# EAGLE design MCU (EAGLE 6.5.0)
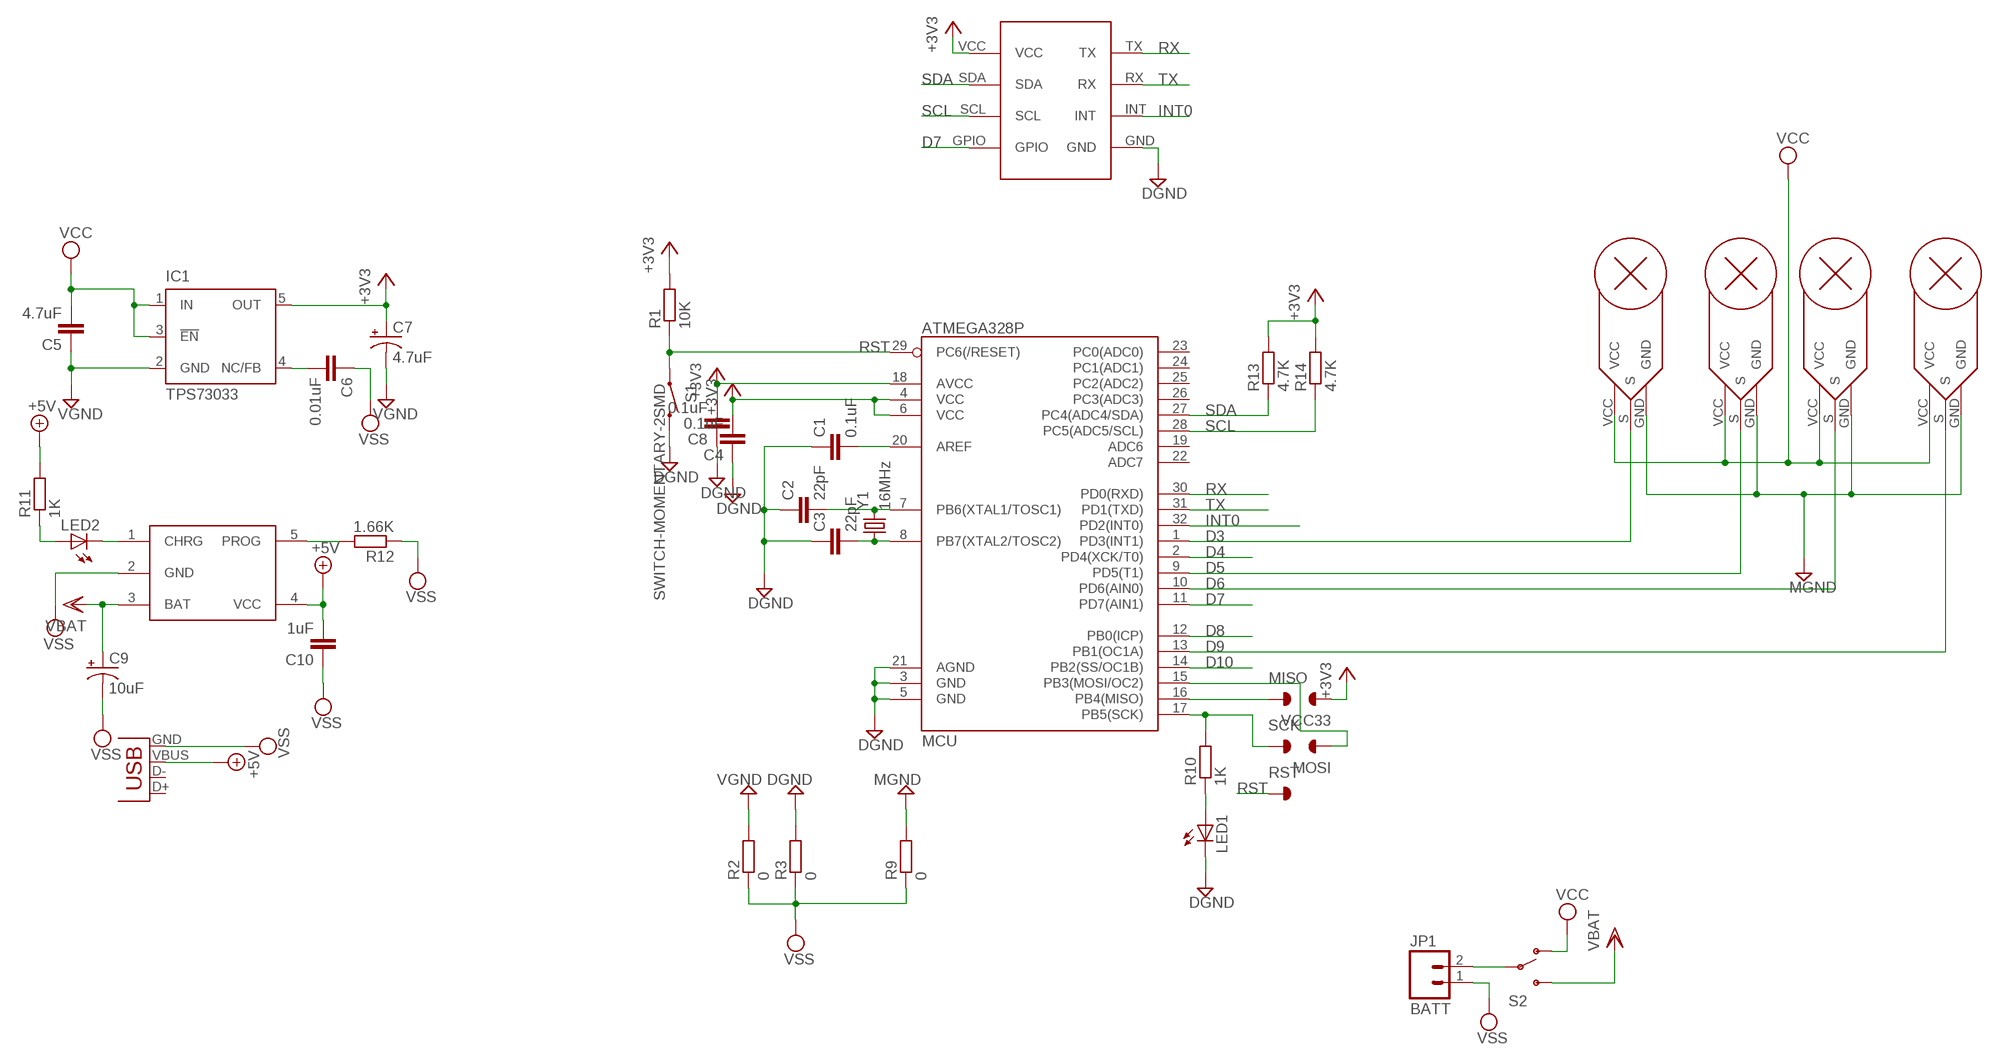
[diagram p0: schematic, sheet 1]

## Parts
C1  0.1uF  C-EUC0805  [C0805]
C2  22pF  C-EUC0603  [C0603]
C3  22pF  C-EUC0603  [C0603]
C4  0.1uF  C-EUC0805  [C0805]
C5  4.7uF  C-EUC0805  [C0805]
C6  0.01uF  C-EUC0805  [C0805]
C7  4.7uF  CAP_POL1206  [EIA3216]
C8  0.1uF  C-EUC0805  [C0805]
C9  10uF  CAP_POL1206  [EIA3216]
C10  1uF  C-EUC0805  [C0805]
IC1  TPS73033  TPS77033  [SOT23-DBV]
JP1  BATT  M02PTH  [1X02]
JP2  USBSMD  [USB-MINIB]
LED1  LEDSML0805  [SML0805]
LED2  LEDSML0805  [SML0805]
MCU  ATMEGA328P  ATMEGA328_SMT  [TQFP32-08]
MISO  xx  POINT  [POINT]
MOSI  xx  POINT  [POINT]
R1  10K  R-EU_R0805  [R0805]
R2  0  R-EU_R0805  [R0805]
R3  0  R-EU_R0805  [R0805]
R9  0  R-EU_R0805  [R0805]
R10  1K  R-EU_R0805  [R0805]
R11  1K  R-EU_R0805  [R0805]
R12  1.66K  R-EU_R0805  [R0805]
R13  4.7K  R-EU_R0805  [R0805]
R14  4.7K  R-EU_R0805  [R0805]
RST  xx  POINT  [POINT]
S1  SWITCH-MOMENTARY-2SMD  [TACTILE_SWITCH_SMD]
S2  SWITCH-SPDT-SMD-A  [SWITCH-SPST-SMD-A]
SCK  xx  POINT  [POINT]
U$1  MOTOR-BOARDHOLDER  [MOTOR-HOLDER]
U$2  MOTOR-BOARDHOLDER  [MOTOR-HOLDER]
U$3  MOTOR-BOARDHOLDER  [MOTOR-HOLDER]
U$4  MOTOR-BOARDHOLDER  [MOTOR-HOLDER]
U$5  TP4055  [SOT23-5]
U$6  BLUESENSORHOLDER  [BLUESENSOR-HOLDER]
VCC33  xx  POINT  [POINT]
Y1  16MHz  CRYSTALHC49US  [HC49US]

## Nets
+3V3: C4.2 C7.A(+) C8.2 IC1.5(OUT) MCU.4(VCC) MCU.6(VCC) MCU.18(AVCC) R1.2 R13.2 R14.2 U$6.VCC VCC33.P$1
+5V: C10.2 JP2.VBUS R11.2 U$5.4(VCC)
D3: MCU.1(PD3(INT1)) U$1.S
D4: MCU.2(PD4(XCK/T0))
D5: MCU.9(PD5(T1)) U$2.S
D6: MCU.10(PD6(AIN0)) U$3.S
D7: MCU.11(PD7(AIN1)) U$6.GPIO
D8: MCU.12(PB0(ICP))
D9: MCU.13(PB1(OC1A)) U$4.S
D10: MCU.14(PB2(SS/OC1B))
DGND: C1.1 C2.1 C3.1 C4.1 C8.1 LED1.C MCU.3(GND) MCU.5(GND) MCU.21(AGND) R3.2 S1.3 U$6.GND
GND1: C5.1 C7.C(-) IC1.2(GND) R2.2 ; supply symbol labelled VGND
GND2: R9.2 U$1.GND U$2.GND U$3.GND U$4.GND ; supply symbol labelled MGND
INT0: MCU.32(PD2(INT0)) U$6.INT
N$5: C1.2 MCU.20(AREF)
N$6: MCU.16(PB4(MISO)) MISO.P$1
N$7: C3.2 MCU.8(PB7(XTAL2/TOSC2)) Y1.1
N$8: C2.2 MCU.7(PB6(XTAL1/TOSC1)) Y1.2
N$9: MCU.17(PB5(SCK)) R10.2 SCK.P$1
N$10: C6.2 IC1.4(NC/FB)
N$11: JP1.2 S2.2(P)
N$12: MCU.15(PB3(MOSI/OC2)) MOSI.P$1
N$17: LED1.A R10.1
N$20: LED2.A R11.1
N$21: LED2.C U$5.1(CHRG)
N$22: R12.2 U$5.5(PROG)
RST: MCU.29(PC6(/RESET)) R1.1 RST.P$1 S1.1
RX: MCU.30(PD0(RXD)) U$6.TX
SCL: MCU.28(PC5(ADC5/SCL)) R14.1 U$6.SCL
SDA: MCU.27(PC4(ADC4/SDA)) R13.1 U$6.SDA
TX: MCU.31(PD1(TXD)) U$6.RX
VCC: C5.2 IC1.1(IN) IC1.3(!EN) S2.1(O) U$1.VCC U$2.VCC U$3.VCC U$4.VCC
VDD: C9.A(+) S2.3(S) U$5.3(BAT) ; supply symbol labelled VBAT
VSS: C6.1 C9.C(-) C10.1 JP1.1 JP2.GND R2.1 R3.1 R9.1 R12.1 U$5.2(GND)
Unconnected: JP2.D+ JP2.D- MCU.19(ADC6) MCU.22(ADC7) MCU.23(PC0(ADC0)) MCU.24(PC1(ADC1)) MCU.25(PC2(ADC2)) MCU.26(PC3(ADC3))

## Library data of the parts
C1-C6 C8 C10 = resistor:C-EU: CAPACITOR, European symbol
C7 C9 = SparkFun-Passives:CAP_POL: Capacitor Polarized These are standard SMD and PTH capacitors. Normally 10uF, 47uF, and 100uF in electrolytic and tantalum varieties. Always verify the external diameter of the through hole cap, it varies with capacity, voltage, and manufacturer. The EIA devices should be standard.
IC1 = texas:TPS770*: ULTRALOW-POWER 50-mA LOW-DROPOUT LINEAR REGULATORS 50-mA Low-Dropout Regulator Source: http://focus.ti.com/lit/ds/symlink/tps77001.pdf; MF: TEXAS INSTRUMENTS; MPN: TPS77033DBVT; OC_FARNELL: 8461570; OC_NEWARK: 77C1187
JP1 = SparkFun-Connectors:M02: Header 2 Standard 2-pin 0.1" header. Use with straight break away headers (SKU : PRT-00116), right angle break away headers (PRT-00553), swiss pins (PRT-00743), machine pins (PRT-00117), and female headers (PRT-00115). Molex polarized connector foot print use with SKU : PRT-08233 with associated crimp pins and housings.
JP2 = SparkFun-Connectors:USB: USB Connectors USB-B-PTH is fully proven SKU : PRT-00139/CONN-08278 USB-miniB is fully proven SKU : PRT-00587 USB-A-PCB is untested. USB-A-H is throughly reviewed, but untested. Spark Fun Electronics SKU : PRT-00437 USB-B-SMT is throughly reviewed, but untested. Needs silkscreen touching up. USB-A-S has not been used/tested USB-MB-H has not been used/tested USB-MICROB has been used. CONN-09505
LED1 LED2 = led:LED: LED OSRAM: - CHIPLED LG R971, LG N971, LY N971, LG Q971, LY Q971, LO R971, LY R971 LH N974, LH R974 LS Q976, LO Q976, LY Q976 LO Q996 - Hyper CHIPLED LW Q18S LB Q993, LB Q99A, LB R99A - SideLED LS A670, LO A670, LY A670, LG A670, LP A670 LB A673, LV A673, LT A673, LW A673 LH A674 LY A675 LS A676, LA A676, LO A676, LY A676, LW A676 LS A679, LY A679, LG A679 - Hyper Micro SIDELED® LS Y876, LA Y876, LO Y876, LY Y876 LT Y87S - SmartLED LW L88C, LW L88S LB L89C, LB L89S, LG L890 LS L89K, LO L89K, LY L89K LS L896, LA L896, LO L896, LY L896 - TOPLED LS T670, LO T670, LY T670, LG T670, LP T670 LSG T670, LSP T670, LSY T670, LOP T670, LYG T670 LG T671, LOG T671, LSG T671 LB T673, LV T673, LT T673, LW T673 LH T674 LS T676, LA T676, LO T676, LY T676, LB T676, LH T676, LSB T676, LW T676 LB T67C, LV T67C, LT T67C, LS T67K, LO T67K, LY T67K, LW E67C LS E67B, LA E67B, LO E67B, LY E67B, LB E67C, LV E67C, LT E67C LW T67C LS T679, LY T679, LG T679 LS T770, LO T770, LY T770, LG T770, LP T770 LB T773, LV T773, LT T773, LW T773 LH T774 LS E675, LA E675, LY E675, LS T675 LS T776, LA T776, LO T776, LY T776, LB T776 LHGB T686 LT T68C, LB T68C - Hyper Mini TOPLED® LB M676 - Mini TOPLED Santana® LG M470 LS M47K, LO M47K, LY M47K Source: http://www.osram.convergy.de LUXEON: - LUMILED® LXK2-PW12-R00, LXK2-PW12-S00, LXK2-PW14-U00, LXK2-PW14-V00 LXK2-PM12-R00, LXK2-PM12-S00, LXK2-PM14-U00 LXK2-PE12-Q00, LXK2-PE12-R00, LXK2-PE12-S00, LXK2-PE14-T00, LXK2-PE14-U00 LXK2-PB12-K00, LXK2-PB12-L00, LXK2-PB12-M00, LXK2-PB14-N00, LXK2-PB14-P00, LXK2-PB14-Q00 LXK2-PR12-L00, LXK2-PR12-M00, LXK2-PR14-Q00, LXK2-PR14-R00 LXK2-PD12-Q00, LXK2-PD12-R00, LXK2-PD12-S00 LXK2-PH12-R00, LXK2-PH12-S00 LXK2-PL12-P00, LXK2-PL12-Q00, LXK2-PL12-R00 Source: www.luxeon.com KINGBRIGHT: KA-3528ASYC Source: www.kingbright.com
MCU = SparkFun-DigitalIC:ATMEGA328_SMT: 32-Pin Atmega328 part Commonly used on Arduino compatible boards Available in QFP and QFN packages TQFP is IC-09069 QFN is non-stock; PROD_ID: IC-09069
MISO MOSI RST SCK VCC33 = Mini-Q:POINT
R1-R3 R9-R14 = resistor:R-EU_: RESISTOR, European symbol
S1 = SparkFun-Electromechanical:SWITCH-MOMENTARY-2: Various NO switches- pushbuttons, reed, etc
S2 = SparkFun-Electromechanical:SWITCH-SPDT: SPDT Switch Simple slide switch, Spark Fun Electronics SKU : COM-00102 DPDT SMT slide switch, AYZ0202, SWCH-08179
U$1-U$4 = Mini-Q:MOTOR-BOARD
U$5 = Mini-Q:TP4055
U$6 = Mini-Q:BLUESENSOR
Y1 = SparkFun-FreqCtrl:CRYSTAL: Various standard crystals. Proven footprints. Spark Fun Electronics SKU : COM-00534

## Board
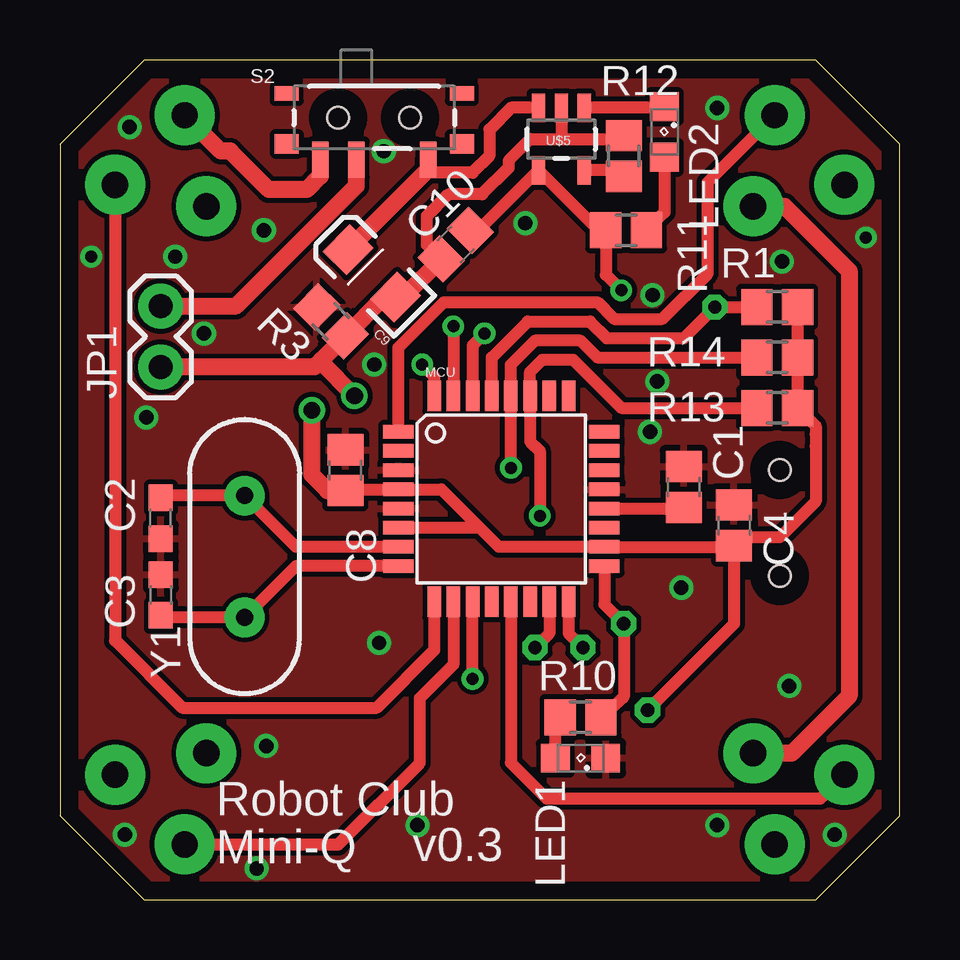
[diagram p1: board, top side]
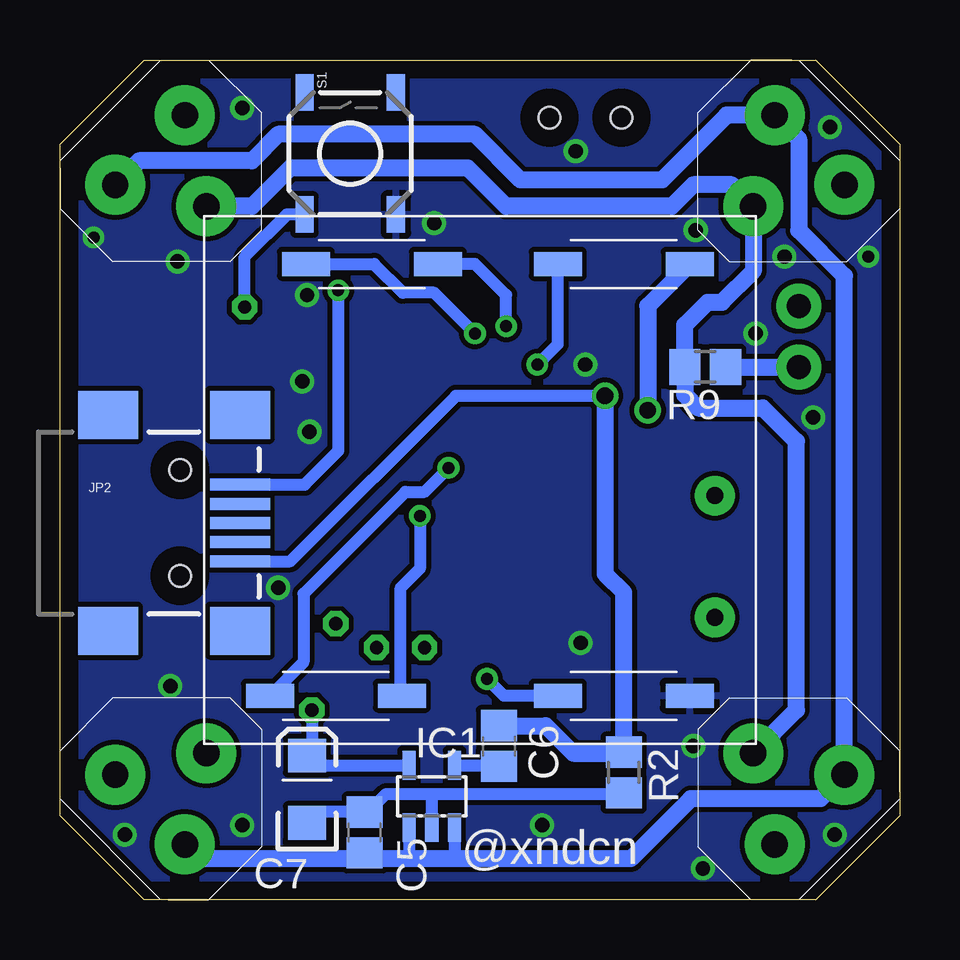
[diagram p2: board, bottom side, seen from below]

Size 35 x 35 mm. Coordinates in mm from the lower left corner, seen from the top.
Outline: 3.5,0 31.5,0 35,3.5 35,31.5 31.5,35 3.5,35 0,31.5 0,3.5 3.5,0
Copper layers (1*16): Top 0.035mm / dielectric 1.5mm / Bottom 0.035mm
Design rules "default *": minimum track width 10mil, minimum drill 16mil, track to track 8mil, track to pad 8mil, pad to pad 8mil, via to via 8mil, smd to smd 8mil, copper to edge 30mil, drill to drill 8mil, minimum pad ring 10mil, minimum via ring 8mil, stop-mask expansion 4mil, vias tented up to drill 0mil, thermal gap 10mil

### Footprints (pad centres in the part's own frame; a part is rotated, then mirrored left to right if it is on the bottom)
C0805 = smd 1.3 x 1.5: 1 -0.85,0; 2 0.85,0
C0603 = smd 1.1 x 1: 1 -0.85,0; 2 0.85,0
EIA3216 = smd 1.4 x 1.6: A 1.4,0; C -1.4,0
SOT23-DBV = smd 0.55 x 1.2: 1 -0.95,-1.3; 2 0,-1.3; 3 0.95,-1.3; 4 0.95,1.3; 5 -0.95,1.3
1X02 = drill 1.016 pad 1.88: 1 0,0; 2 2.54,0
USB-MINIB = smd 2.5 x 0.5: D+ 2.5,0; D- 2.5,0.8; GND 2.5,-1.6; ID 2.5,-0.8; VBUS 2.5,1.6 | smd 2.5 x 2: MTN1 -3,4.5; MTN2 2.5,4.5; MTN3 -3,-4.5; MTN4 2.5,-4.5 | hole 0.9: 0,2.2; 0,-2.2
SML0805 = smd 1.2 x 1.2: A 1.05,0; C -1.05,0
TQFP32-08 = smd 1.27 x 0.559: 1 -4.293,2.8; 2 -4.293,2; 3 -4.293,1.2; 4 -4.293,0.4; 5 -4.293,-0.4; 6 -4.293,-1.2; 7 -4.293,-2; 8 -4.293,-2.8; 17 4.293,-2.8; 18 4.293,-2; 19 4.293,-1.2; 20 4.293,-0.4; 21 4.293,0.4; 22 4.293,1.2; 23 4.293,2; 24 4.293,2.8 | smd 0.559 x 1.27: 9 -2.8,-4.293; 10 -2,-4.293; 11 -1.2,-4.293; 12 -0.4,-4.293; 13 0.4,-4.293; 14 1.2,-4.293; 15 2,-4.293; 16 2.8,-4.293; 25 2.8,4.293; 26 2,4.293; 27 1.2,4.293; 28 0.4,4.293; 29 -0.4,4.293; 30 -1.2,4.293; 31 -2,4.293; 32 -2.8,4.293
POINT = drill 0.55 octagon: P$1 0,0
R0805 = smd 1.3 x 1.5: 1 -0.85,0; 2 0.85,0
TACTILE_SWITCH_SMD = smd 1.524 x 0.762: 1 -2.54,1.905; 2 2.54,1.905; 3 -2.54,-1.905; 4 2.54,-1.905
SWITCH-SPST-SMD-A = smd 0.7 x 1.5: 1 -2.25,-1.75; 2 -0.75,-1.75; 3 2.25,-1.75 | smd 1 x 0.6: GND1 -3.65,1; GND3 3.65,1 | smd 1 x 0.8: GND2 -3.65,-1.1; GND4 3.65,-1.1 | hole 0.9: -1.5,0; 1.5,0
MOTOR-HOLDER = drill 1.1 pad 2.5: GND 0,0; S -0.9,3.8; VCC -3.8,0.9
SOT23-5 = smd 0.55 x 1.2: 1 -0.95,-1.3; 2 0,-1.3; 3 0.95,-1.3; 4 0.95,1.3; 5 -0.95,1.3
BLUESENSOR-HOLDER = smd 1 x 2: GND -9,-8.75; GPIO -9,-3.25; INT 9,-3.25; RX 9,1.75; SCL -9,8.75; SDA -9,3.25; TX 9,7.25; VCC 9,-8.75
HC49US = drill 0.7 pad 1.651: 1 -2.54,0; 2 2.54,0

### Placement (x,y rotation side)
C1  26,17.2 270 top
C2  4.2,15.9 90 top
C3  4.2,12.7 270 top
C4  28.1,15.6 270 top
C5  22.3,2.8 270 bottom
C6  16.7,6.4 270 bottom
C7  24.7,4.6 90 bottom
C8  11.9,17.9 270 top
C9  13,26.1 135 top
C10  16.5,27.3 45 top
IC1  19.5,4.3 0 bottom
JP1  4.2,22.2 90 top
JP2  30,15.7 0 bottom
LED1  21.7,5.9 180 top
LED2  25.2,32 270 top
MCU  18.4,16.7 0 top
MISO  21.8,10.5 0 top
MOSI  19.8,10.5 0 top
R1  29.9,24.7 0 top
R2  11.5,5.3 270 bottom
R3  11.3,24.1 135 top
R9  8.1,22.2 180 bottom
R10  21.7,7.6 0 top
R11  23.6,27.9 180 top
R12  23.5,31 270 top
R13  29.9,20.5 0 top
R14  29.9,22.6 0 top
RST  27.3,24.7 0 top
S1  22.9,31.1 90 bottom
S2  13.1,32.6 0 top
SCK  23.5,11.5 0 top
U$1  28.9,28.9 0 bottom
U$2  6.1,28.9 270 bottom
U$3  6.1,6.1 180 bottom
U$4  28.9,6.1 90 bottom
U$5  20.9,31.7 180 top
U$6  17.5,17.5 90 bottom
VCC33  24.5,7.9 0 top
Y1  7.7,14.3 90 top

### Tracks (layer width: path | path; a pad name or v marks a point on that pad's centre or on a via)
+3V3  (via drill 0.7)
  Top 0.5: R13.2 R14.2 R1.2 | C8.2 11.65,17.1 MCU.4 15.9,17.1 17.5,15.5 | 17.5,15.5 18.3,14.7 MCU.18 28.25,14.7 C4.2 | 17.5,15.5 MCU.6 | C4.2 28.1,11.5 VCC33.P$1 | R13.2 30.75,20.55 | C4.2 28.45,15.1 30,15.1 31.5,16.6 31.5,18.9 31.5,19.4 31.5,19.75 R13.2
  Top 0.7: v10.5,20.4 10.5,17.7 11.15,17.05 C8.2
  Bottom 0.5: IC1.5 24.5,5.6 C7.A 24.5,6.2 VCC33.P$1
  Bottom 0.7: v10.5,20.4 10.5,24.75 U$6.VCC
+5V  (via drill 0.5)
  Top 0.5: C10.2 17.45,27.9 U$5.4 22.45,27.9 R11.2 22.75,26.05 v23.4,25.4
  Bottom 0.5: JP2.VBUS 24.8,17.3 23.4,18.7 v23.4,25.4
D3
  Top 0.5: MCU.1 14.11,23.01 16,24.9 22.4,24.9 23.1,24.2 25.1,24.2 27,26.1 27,29.9 U$1.S
D5
  Top 0.5: U$2.S 2.3,10.8 5.1,8 13.2,8 15.6,10.4 MCU.9
D6
  Top 0.5: MCU.10 16.4,9.8 15,8.4 15,5.7 11.6,2.3 U$3.S
D7  (via drill 0.5)
  Top 0.5: v17.2,9.2 MCU.11
  Bottom 0.5: U$6.GPIO 16.5,8.5 v17.2,9.2
D9
  Top 0.5: MCU.13 18.8,5.7 20.3,4.2 31.7,4.2 U$4.S
DGND  (via drill 0.5, 0.6)
  other vias: 24.9,21.6 2.9,32.2 8.5,27.9 14.9,3.1 3.6,20.1 27.4,33 2.7,2.7 32.3,2.7 1.3,26.8 19.4,28.2 30.4,8.9 13.3,10.7 8.6,6.4 4.8,26.8 13.5,31.2 25.9,13 24.6,19.5 13.1,22.3 24.7,25.2 30.1,26.6 6,23.6 27.4,3.1 33.6,27.6 8.2,1.3
  pour Top: 0,35 35,35 35,0 0,0
  pour Bottom: -0.1,35.1 35.1,35.1 35.1,-0.1 -0.1,-0.1
GND1
  Bottom 0.5: IC1.2 19.5,4.4 | 19.5,4.4 11.55,4.4 R2.2 | 19.5,4.4 21.4,4.4 22.15,3.65 C5.1 24.25,3.65 C7.C
GND2
  Top 0.7: U$1.GND 30.2,28.9 32.9,26.2 32.9,8.5 30.5,6.1 U$4.GND
  Bottom 0.7: U$1.GND 27,28.9 25.4,30.5 18,30.5 16.4,28.9 9.5,28.9 8.6,29.8 7,29.8 U$2.GND 6.1,26.2 7.4,24.9 8,24.9 8.95,23.95 R9.2 8.95,21.05 8.4,20.5 5.7,20.5 4.3,19.1 4.3,7.9 U$3.GND
INT0  (via drill 0.5)
  Top 0.5: v15.1,22.3 15.6,21.8 MCU.32
  Bottom 0.5: U$6.INT 14.25,23.15 v15.1,22.3
N$5
  Top 0.5: MCU.20 26.15,16.3 C1.2
N$6
  Top 0.5: MCU.16 21.2,11.1 MISO.P$1
N$7
  Top 0.5: MCU.8 9.84,13.9 Y1.1 4.29,11.76 C3.2
N$8
  Top 0.5: MCU.7 9.84,14.7 Y1.2 4.29,16.84 C2.2
N$9
  Top 0.5: MCU.17 22.69,12.31 SCK.P$1 23.5,8.45 R10.2
N$10
  Bottom 0.5: IC1.4 16.75,5.6 C6.2
N$11
  Top 0.7: S2.2 12.35,29.75 7.34,24.74 JP1.2
N$12
  Top 0.5: MCU.15 20.4,11.1 MOSI.P$1
N$17
  Top 0.5: LED1.A 20.65,7.4 R10.1
N$20
  Top 0.5: LED2.A 25.2,28.65 R11.1
N$21
  Top 0.5: LED2.C 24.95,33 U$5.1
N$22
  Top 0.5: R12.2 23.65,30.4 U$5.5
RST
  Top 0.5: MCU.29 18,22.6 19.5,24.1 22.1,24.1 22.8,23.4 26,23.4 RST.P$1 R1.1
  Bottom 0.5: RST.P$1 27.3,26.8 25.54,28.56 S1.1
RX  (via drill 0.5)
  Top 0.5: MCU.30 17.2,23.1 v17.7,23.6
  Bottom 0.5: v17.7,23.6 19.4,25.3 20.7,25.3 21.9,26.5 U$6.TX
SCL  (via drill 0.5)
  Top 0.5: v18.8,18 MCU.28 18.8,22.3 19.8,23.3 21.7,23.3 22.4,22.6 R14.1
  Bottom 0.5: v18.8,18 19.8,17 20.6,17 24.85,12.75 24.85,9.9 U$6.SCL
SDA  (via drill 0.5)
  Top 0.5: R13.1 23.4,20.5 21.4,22.5 20.1,22.5 19.6,22 MCU.27 19.6,19.1 20,18.7 v20,16
  Bottom 0.5: U$6.SDA 20.8,8.55 20.8,13 20,13.8 v20,16
TX  (via drill 0.5)
  Top 0.5: v16.4,23.9 MCU.31
  Bottom 0.5: 19.2,26.5 U$6.RX 17.7,26.5 16.4,25.2 v16.4,23.9
VCC
  Top 0.7: S2.1 10.85,30.15 10.3,29.6 8.7,29.6 7.1,31.2 6.7,31.2 U$2.VCC
  Bottom 0.5: 18.55,2.95 IC1.3 18.55,1.85 18.7,1.7 | C5.2 22.5,1.8 22.4,1.7 | IC1.1 20.45,1.75 20.5,1.7
  Bottom 0.7: U$1.VCC 31.7,30.8 27,30.8 25.9,31.9 17.7,31.9 15.8,30 9.9,30 7.2,32.7 U$2.VCC 4.2,31.7 4.2,27.9 2.3,26 U$3.VCC 3.3,4.2 8.7,4.2 11.2,1.7 18.7,1.7 20.5,1.7 22.4,1.7 29.2,1.7 U$4.VCC
VDD
  Top 0.5: U$5.3 18.8,33 17.9,32.1 17.9,31 17.2,30.3 15.3,30.3 15.26,30.34
  Top 0.7: S2.3 15.35,30.43 15.26,30.34 C9.A
VSS  (via drill 0.7)
  Top 0.5: C10.1 15.3,27.3 15.3,28.5 16.2,29.4 17.6,29.4 18.7,30.5 18.7,30.8 19.6,31.7 20.9,31.7 | 20.9,31.7 23.4,31.7 23.7,32 R12.1 | U$5.2 20.9,31.7
  Top 0.7: C10.1 14.41,25.21 14.41,25.11 C9.C 13.51,25.11 R3.1 10.9,22.5 | JP1.1 10.6,22.2 10.9,22.5 | v12.28,21 10.9,22.38 10.9,22.5
  Bottom 0.5: JP2.GND 25.4,14.1 18.5,21 v12.28,21
  Bottom 0.7: v12.28,21 12.28,13.58 11.5,12.8 R2.1 11.55,6.1 13.6,6.1 14.75,7.25 C6.1 | R9.1 JP1.1

### Text on the board
tNames: Robot Club | Mini-Q | v0.3
bNames: @xndcn